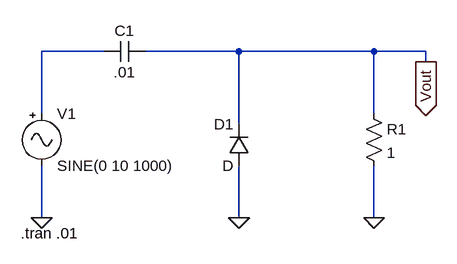
[diagram p0: schematic Q2.asc]
Q2.asc, the LTspice schematic file:
Version 4
SHEET 1 880 680
WIRE 128 16 32 16
WIRE 336 16 192 16
WIRE 544 16 336 16
WIRE 624 16 544 16
WIRE 624 32 624 16
WIRE 32 112 32 16
WIRE 544 112 544 16
WIRE 336 128 336 16
WIRE 32 272 32 192
WIRE 336 272 336 192
WIRE 544 272 544 192
FLAG 624 32 Vout
IOPIN 624 32 Out
FLAG 32 272 0
FLAG 336 272 0
FLAG 544 272 0
SYMBOL cap 192 0 R90
WINDOW 0 0 32 VBottom 2
WINDOW 3 32 32 VTop 2
SYMATTR InstName C1
SYMATTR Value .01
SYMBOL diode 352 192 R180
WINDOW 0 24 64 Left 2
WINDOW 3 24 0 Left 2
SYMATTR InstName D1
SYMBOL res 528 96 R0
SYMATTR InstName R1
SYMATTR Value 1
SYMBOL Misc\\signal 32 96 R0
WINDOW 123 0 0 Left 0
WINDOW 39 0 0 Left 0
SYMATTR InstName V1
SYMATTR Value SINE(0 10 1000)
TEXT 0 296 Left 2 !.tran .01

The netlist it stands for:
* Q2.asc
C1 Vout N001 .01
D1 0 Vout D
R1 Vout 0 1
V1 N001 0 SINE(0 10 1000)
.model D D
.lib standard.dio
.tran .01
.backanno
.end